# Altium schematic sheet PLD_Top.SchDoc: Top
size A2; SheetTotal: 32
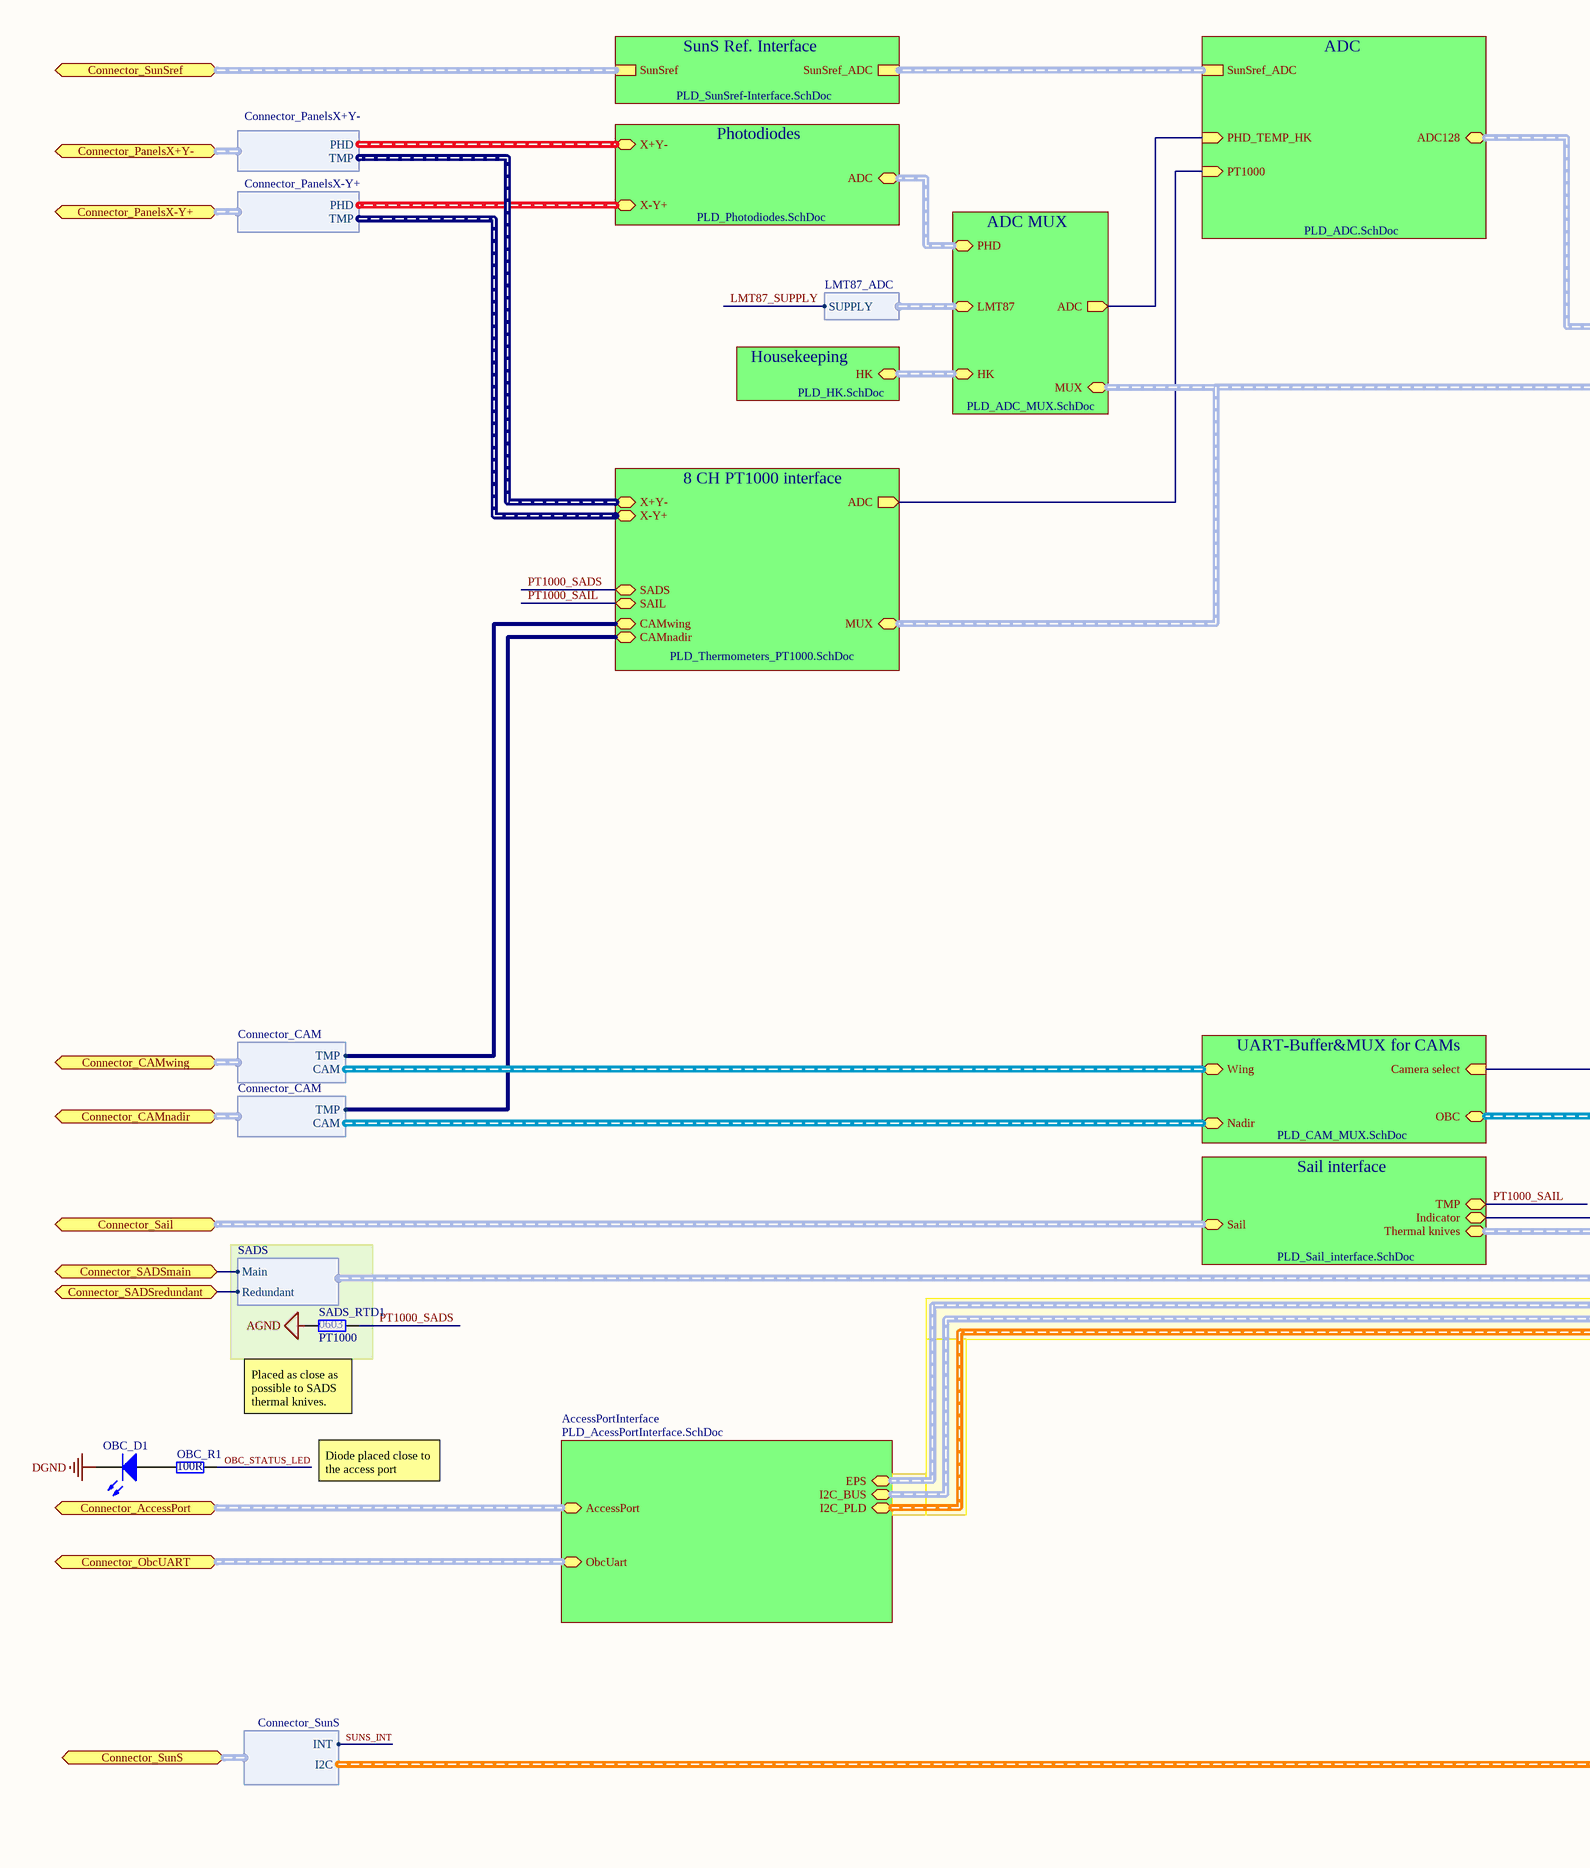
[diagram p0: PLD_Top.SchDoc, left]
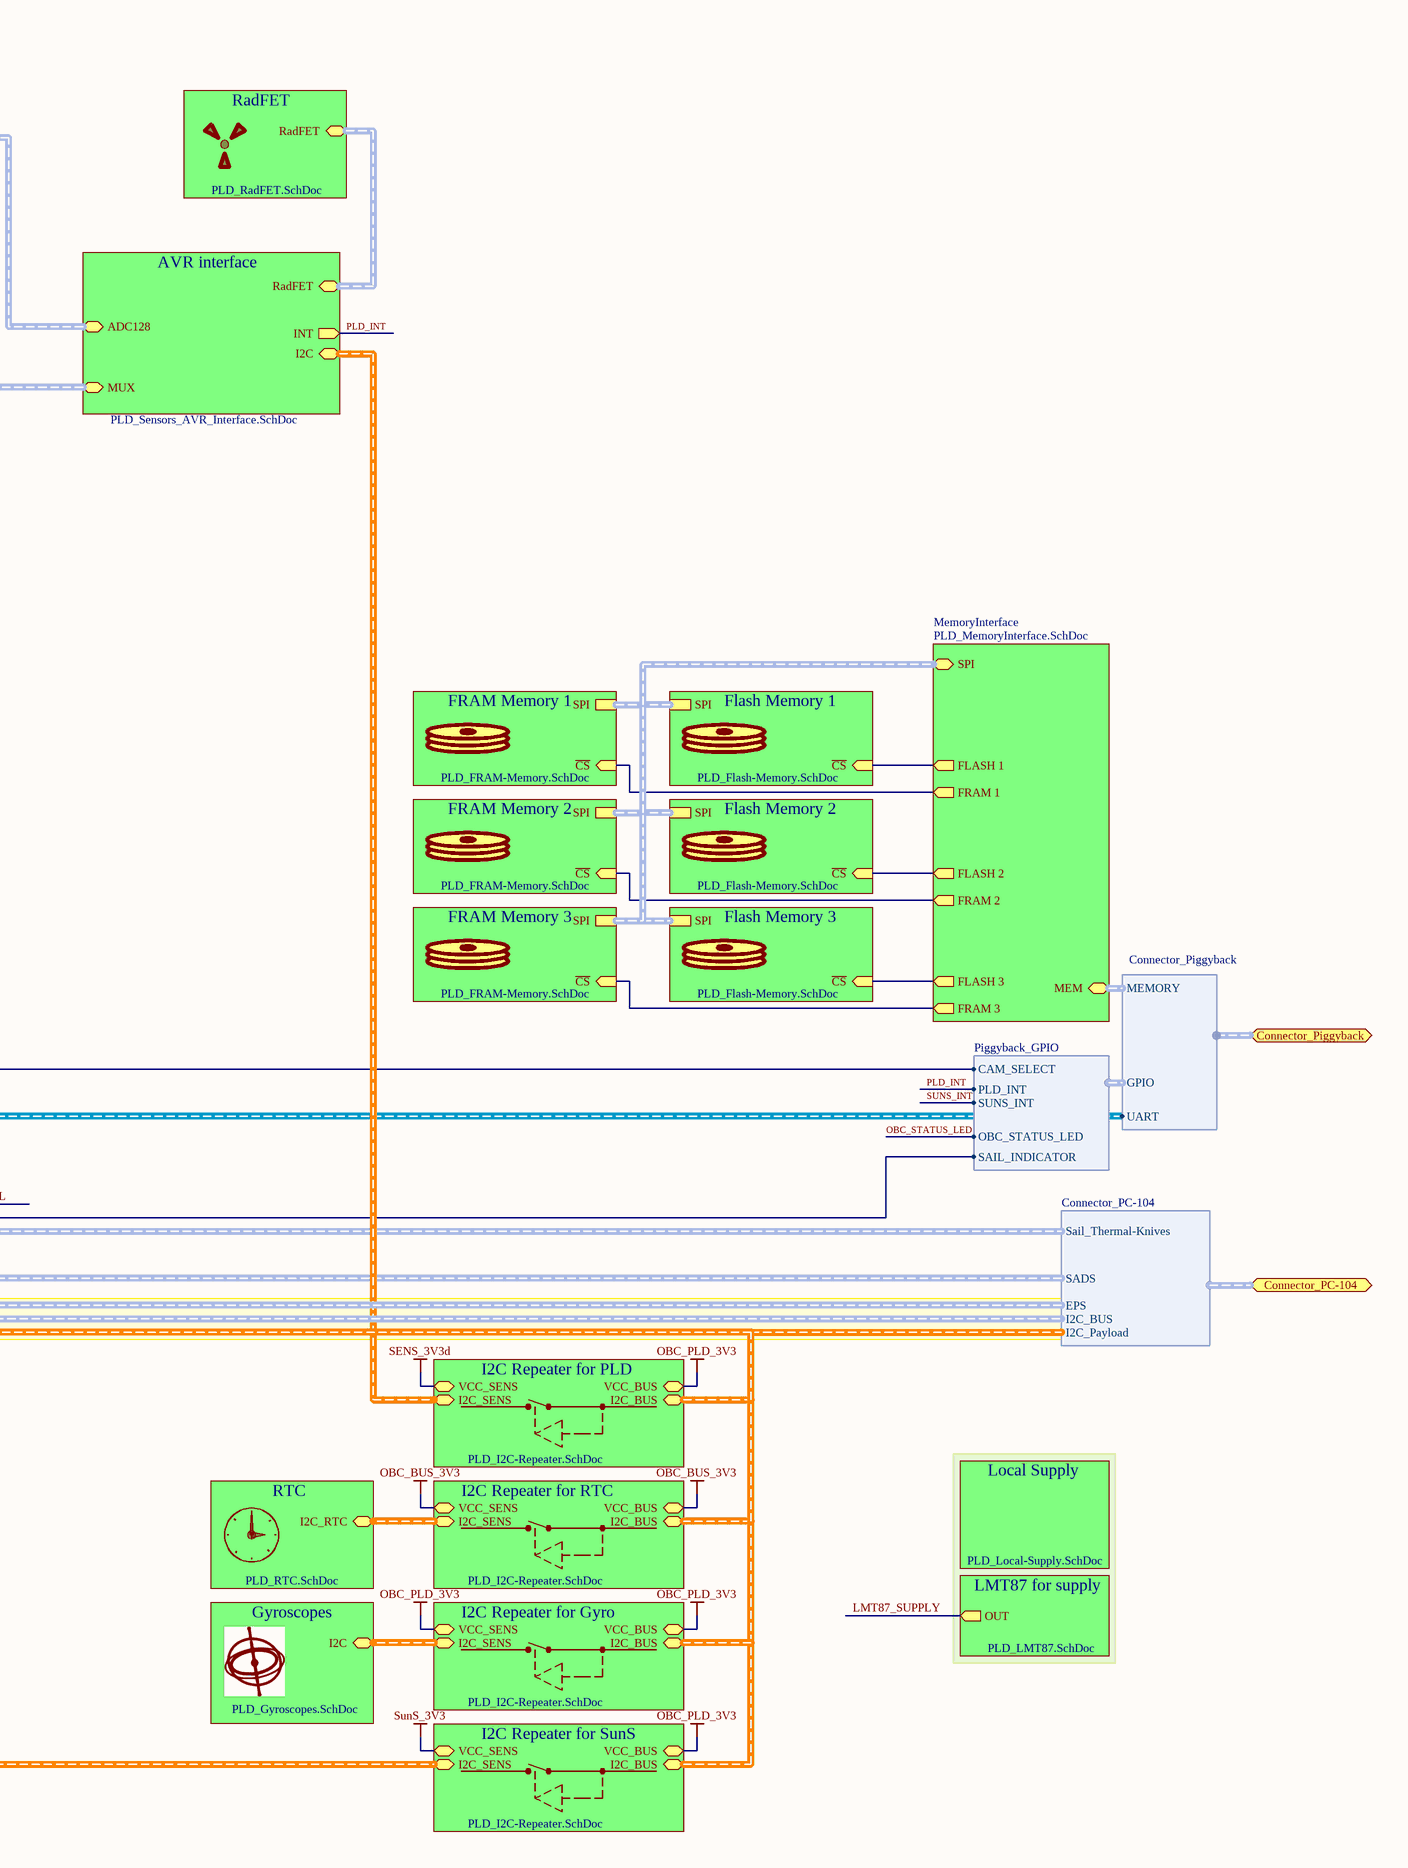
[diagram p1: PLD_Top.SchDoc, right]

## Parts
OBC_D1  LEDX  [LED 0805 Blue]  (value not drawn)
OBC_R1  100R  [SMD_Resistor_0603]
SADS_RTD1  Package: 0603  [SMD_Resistor_0603]  (hidden comment: PT1000)

## Sub-sheets
8 CH PT1000 interface = PLD_Thermometers_PT1000.SchDoc: MUX (harness MUX), ADC (out), CAMwing, CAMnadir, X-Y+ (harness PanelsX-Y+), X+Y- (harness PanelsX+Y-), SADS (bidir), SAIL (bidir)
AccessPortInterface = PLD_AcessPortInterface.SchDoc: AccessPort (harness AccessPort), ObcUart (harness UART), I2C_BUS (harness I2C), I2C_PLD (harness I2C), EPS (harness EPS_ACCESSPORT)
ADC = PLD_ADC.SchDoc: SunSref_ADC (harness SunSref_ADC), PHD_TEMP_HK (in), PT1000 (in), ADC128 (harness ADC128)
ADC MUX = PLD_ADC_MUX.SchDoc: LMT87 (harness LMT87_ADC), HK (harness HK_ADC), ADC (out), MUX (harness MUX), PHD (harness PHD_ADC)
AVR interface = PLD_Sensors_AVR_Interface.SchDoc: I2C (harness I2C), RadFET (harness RadFET), ADC128 (harness ADC128), MUX (harness MUX), INT (out)
Flash Memory 1 = PLD_Flash-Memory.SchDoc: SPI (harness SPI), ~{CS} (in)
Flash Memory 2 = PLD_Flash-Memory.SchDoc: SPI (harness SPI), ~{CS} (in)
Flash Memory 3 = PLD_Flash-Memory.SchDoc: SPI (harness SPI), ~{CS} (in)
FRAM Memory 1 = PLD_FRAM-Memory.SchDoc: SPI (harness SPI), ~{CS} (in)
FRAM Memory 2 = PLD_FRAM-Memory.SchDoc: SPI (harness SPI), ~{CS} (in)
FRAM Memory 3 = PLD_FRAM-Memory.SchDoc: SPI (harness SPI), ~{CS} (in)
Gyroscopes = PLD_Gyroscopes.SchDoc: I2C (harness I2C)
Housekeeping = PLD_HK.SchDoc: HK (harness HK_ADC)
I2C Repeater for Gyro = PLD_I2C-Repeater.SchDoc: I2C_BUS (harness I2C), VCC_SENS, VCC_BUS, I2C_SENS (harness I2C)
I2C Repeater for PLD = PLD_I2C-Repeater.SchDoc: I2C_BUS (harness I2C), VCC_SENS, VCC_BUS, I2C_SENS (harness I2C)
I2C Repeater for RTC = PLD_I2C-Repeater.SchDoc: I2C_BUS (harness I2C), VCC_SENS, VCC_BUS, I2C_SENS (harness I2C)
I2C Repeater for SunS = PLD_I2C-Repeater.SchDoc: I2C_BUS (harness I2C), VCC_SENS, VCC_BUS, I2C_SENS (harness I2C)
LMT87 for supply = PLD_LMT87.SchDoc: OUT (out)
Local Supply = PLD_Local-Supply.SchDoc: no entries
MemoryInterface = PLD_MemoryInterface.SchDoc: FLASH 1 (out), SPI (harness SPI), FRAM 1 (out), FLASH 2 (out), FLASH 3 (out), FRAM 2 (out), FRAM 3 (out), MEM (harness MEMORY)
Photodiodes = PLD_Photodiodes.SchDoc: X-Y+ (harness PanelsX-Y+), X+Y- (harness PanelsX+Y-), ADC (harness PHD_ADC)
RadFET = PLD_RadFET.SchDoc: RadFET (harness RadFET)
RTC = PLD_RTC.SchDoc: I2C_RTC (harness I2C)
Sail interface = PLD_Sail_interface.SchDoc: TMP (bidir), Indicator, Sail (harness Connector_Sail), Thermal knives (harness Sail_Thermal-Knives)
SunS Ref. Interface = PLD_SunSref-Interface.SchDoc: SunSref (harness Connector_SunSref), SunSref_ADC (harness SunSref_ADC)
UART-Buffer&MUX for CAMs = PLD_CAM_MUX.SchDoc: Camera select (in), OBC (harness UART), Wing (harness CAM), Nadir (harness CAM)

## Ports
Connector_AccessPort (harness AccessPort), Connector_CAMnadir (harness Connector_CAM), Connector_CAMwing (harness Connector_CAM), Connector_ObcUART (harness UART), Connector_PanelsX+Y- (harness Connector_PanelsX+Y-), Connector_PanelsX-Y+ (harness Connector_PanelsX-Y+), Connector_PC-104 (harness Connector_PC-104), Connector_Piggyback (harness Connector_Piggyback), Connector_SADSmain, Connector_SADSredundant, Connector_Sail (harness Connector_Sail), Connector_SunS (harness Connector_SunS), Connector_SunSref (harness Connector_SunSref)

## Harnesses
Connector_CAM: CAM, TMP
Connector_PanelsX+Y-: TMP, PHD
Connector_PanelsX-Y+: PHD, TMP
Connector_PC-104: I2C_Payload, Sail_Thermal-Knives, SADS, I2C_BUS, EPS
SADS: Main, Redundant
LMT87_ADC: SUPPLY
Connector_SunS: I2C, INT
Connector_Piggyback: UART, GPIO, MEMORY
Piggyback_GPIO: CAM_SELECT, PLD_INT, SAIL_INDICATOR, SUNS_INT, OBC_STATUS_LED

## Nets
AGND: SADS_RTD1.1
DGND: OBC_D1.2(K)
OBC_BUS_3V3: sheet I2C Repeater for RTC/VCC_SENS, sheet I2C Repeater for RTC/VCC_BUS
OBC_PLD_3V3: sheet I2C Repeater for PLD/VCC_BUS, sheet I2C Repeater for SunS/VCC_BUS, sheet I2C Repeater for Gyro/VCC_SENS, sheet I2C Repeater for Gyro/VCC_BUS
SENS_3V3d: sheet I2C Repeater for PLD/VCC_SENS
SunS_3V3: sheet I2C Repeater for SunS/VCC_SENS
Connector_SADSmain: port Connector_SADSmain, harness SADS.Main
Connector_SADSredundant: port Connector_SADSredundant, harness SADS.Redundant
LMT87_SUPPLY: sheet LMT87 for supply/OUT, sheet ADC MUX/LMT87.SUPPLY
OBC_STATUS_LED: OBC_R1.2 ; harness Piggyback_GPIO.OBC_STATUS_LED
PLD_INT: sheet AVR interface/INT, harness Piggyback_GPIO.PLD_INT
PT1000_SADS: SADS_RTD1.2 ; sheet 8 CH PT1000 interface/SADS
PT1000_SAIL: sheet Sail interface/TMP, sheet 8 CH PT1000 interface/SAIL
SUNS_INT: port Connector_SunS.INT, harness Piggyback_GPIO.SUNS_INT
NetOBC_D1_1: OBC_D1.1(A) OBC_R1.1
(unnamed): sheet Sail interface/Indicator, harness Piggyback_GPIO.SAIL_INDICATOR
(unnamed): sheet UART-Buffer&MUX for CAMs/Camera select, harness Piggyback_GPIO.CAM_SELECT
(unnamed): sheet ADC/PHD_TEMP_HK, sheet ADC MUX/ADC
(unnamed): sheet ADC/PT1000, sheet 8 CH PT1000 interface/ADC
(unnamed): sheet Flash Memory 3/~{CS}, sheet MemoryInterface/FLASH 3
(unnamed): sheet 8 CH PT1000 interface/CAMwing, port Connector_CAMwing.TMP
(unnamed): sheet 8 CH PT1000 interface/CAMnadir, port Connector_CAMnadir.TMP
(unnamed): sheet FRAM Memory 1/~{CS}, sheet MemoryInterface/FRAM 1
(unnamed): sheet Flash Memory 2/~{CS}, sheet MemoryInterface/FLASH 2
(unnamed): sheet Flash Memory 1/~{CS}, sheet MemoryInterface/FLASH 1
(unnamed): sheet FRAM Memory 2/~{CS}, sheet MemoryInterface/FRAM 2
(unnamed): sheet FRAM Memory 3/~{CS}, sheet MemoryInterface/FRAM 3

## Buses and harness runs
harness port Connector_AccessPort = sheet AccessPortInterface/AccessPort
harness port Connector_ObcUART = sheet AccessPortInterface/ObcUart
harness port Connector_Sail = sheet Sail interface/Sail
harness port Connector_SunSref = sheet SunS Ref. Interface/SunSref
harness sheet 8 CH PT1000 interface/MUX = sheet ADC MUX/MUX = sheet AVR interface/MUX
harness sheet AccessPortInterface/I2C_PLD = sheet I2C Repeater for Gyro/I2C_BUS = sheet I2C Repeater for PLD/I2C_BUS = sheet I2C Repeater for RTC/I2C_BUS = sheet I2C Repeater for SunS/I2C_BUS
harness sheet ADC MUX/HK = sheet Housekeeping/HK
harness sheet ADC MUX/PHD = sheet Photodiodes/ADC
harness sheet ADC/ADC128 = sheet AVR interface/ADC128
harness sheet ADC/SunSref_ADC = sheet SunS Ref. Interface/SunSref_ADC
harness sheet AVR interface/I2C = sheet I2C Repeater for PLD/I2C_SENS
harness sheet AVR interface/RadFET = sheet RadFET/RadFET
harness sheet Flash Memory 1/SPI = sheet Flash Memory 2/SPI = sheet Flash Memory 3/SPI = sheet FRAM Memory 1/SPI = sheet FRAM Memory 2/SPI = sheet FRAM Memory 3/SPI = sheet MemoryInterface/SPI
harness sheet Gyroscopes/I2C = sheet I2C Repeater for Gyro/I2C_SENS
harness sheet I2C Repeater for RTC/I2C_SENS = sheet RTC/I2C_RTC

## Notes on the sheet
- (near SADS_RTD1) Placed as close as possible to SADS thermal knives.
- Diode placed close to the access port
- Title:
- Project:
- Author:
- Model:
- File name:
- Document Number:
- Checked by:
- Rev:
- Date:
- Approved by:
- Sheet:
- of

## Library data of the parts
OBC_D1 = LEDX: Typical LED
OBC_R1 = Res: Value: 100R; Package: 0603
SADS_RTD1 = PTS060301B100RP100: PT1000 Vishay PTS060301B100RP100; Manufacturer: Vishay; ManufacturerPartNumber: PTS060301B100RP100; Value: PT1000